# Altium schematic sheet LEAKCAM.SchDoc
size A2; SheetNumber: 1; SheetTotal: 8
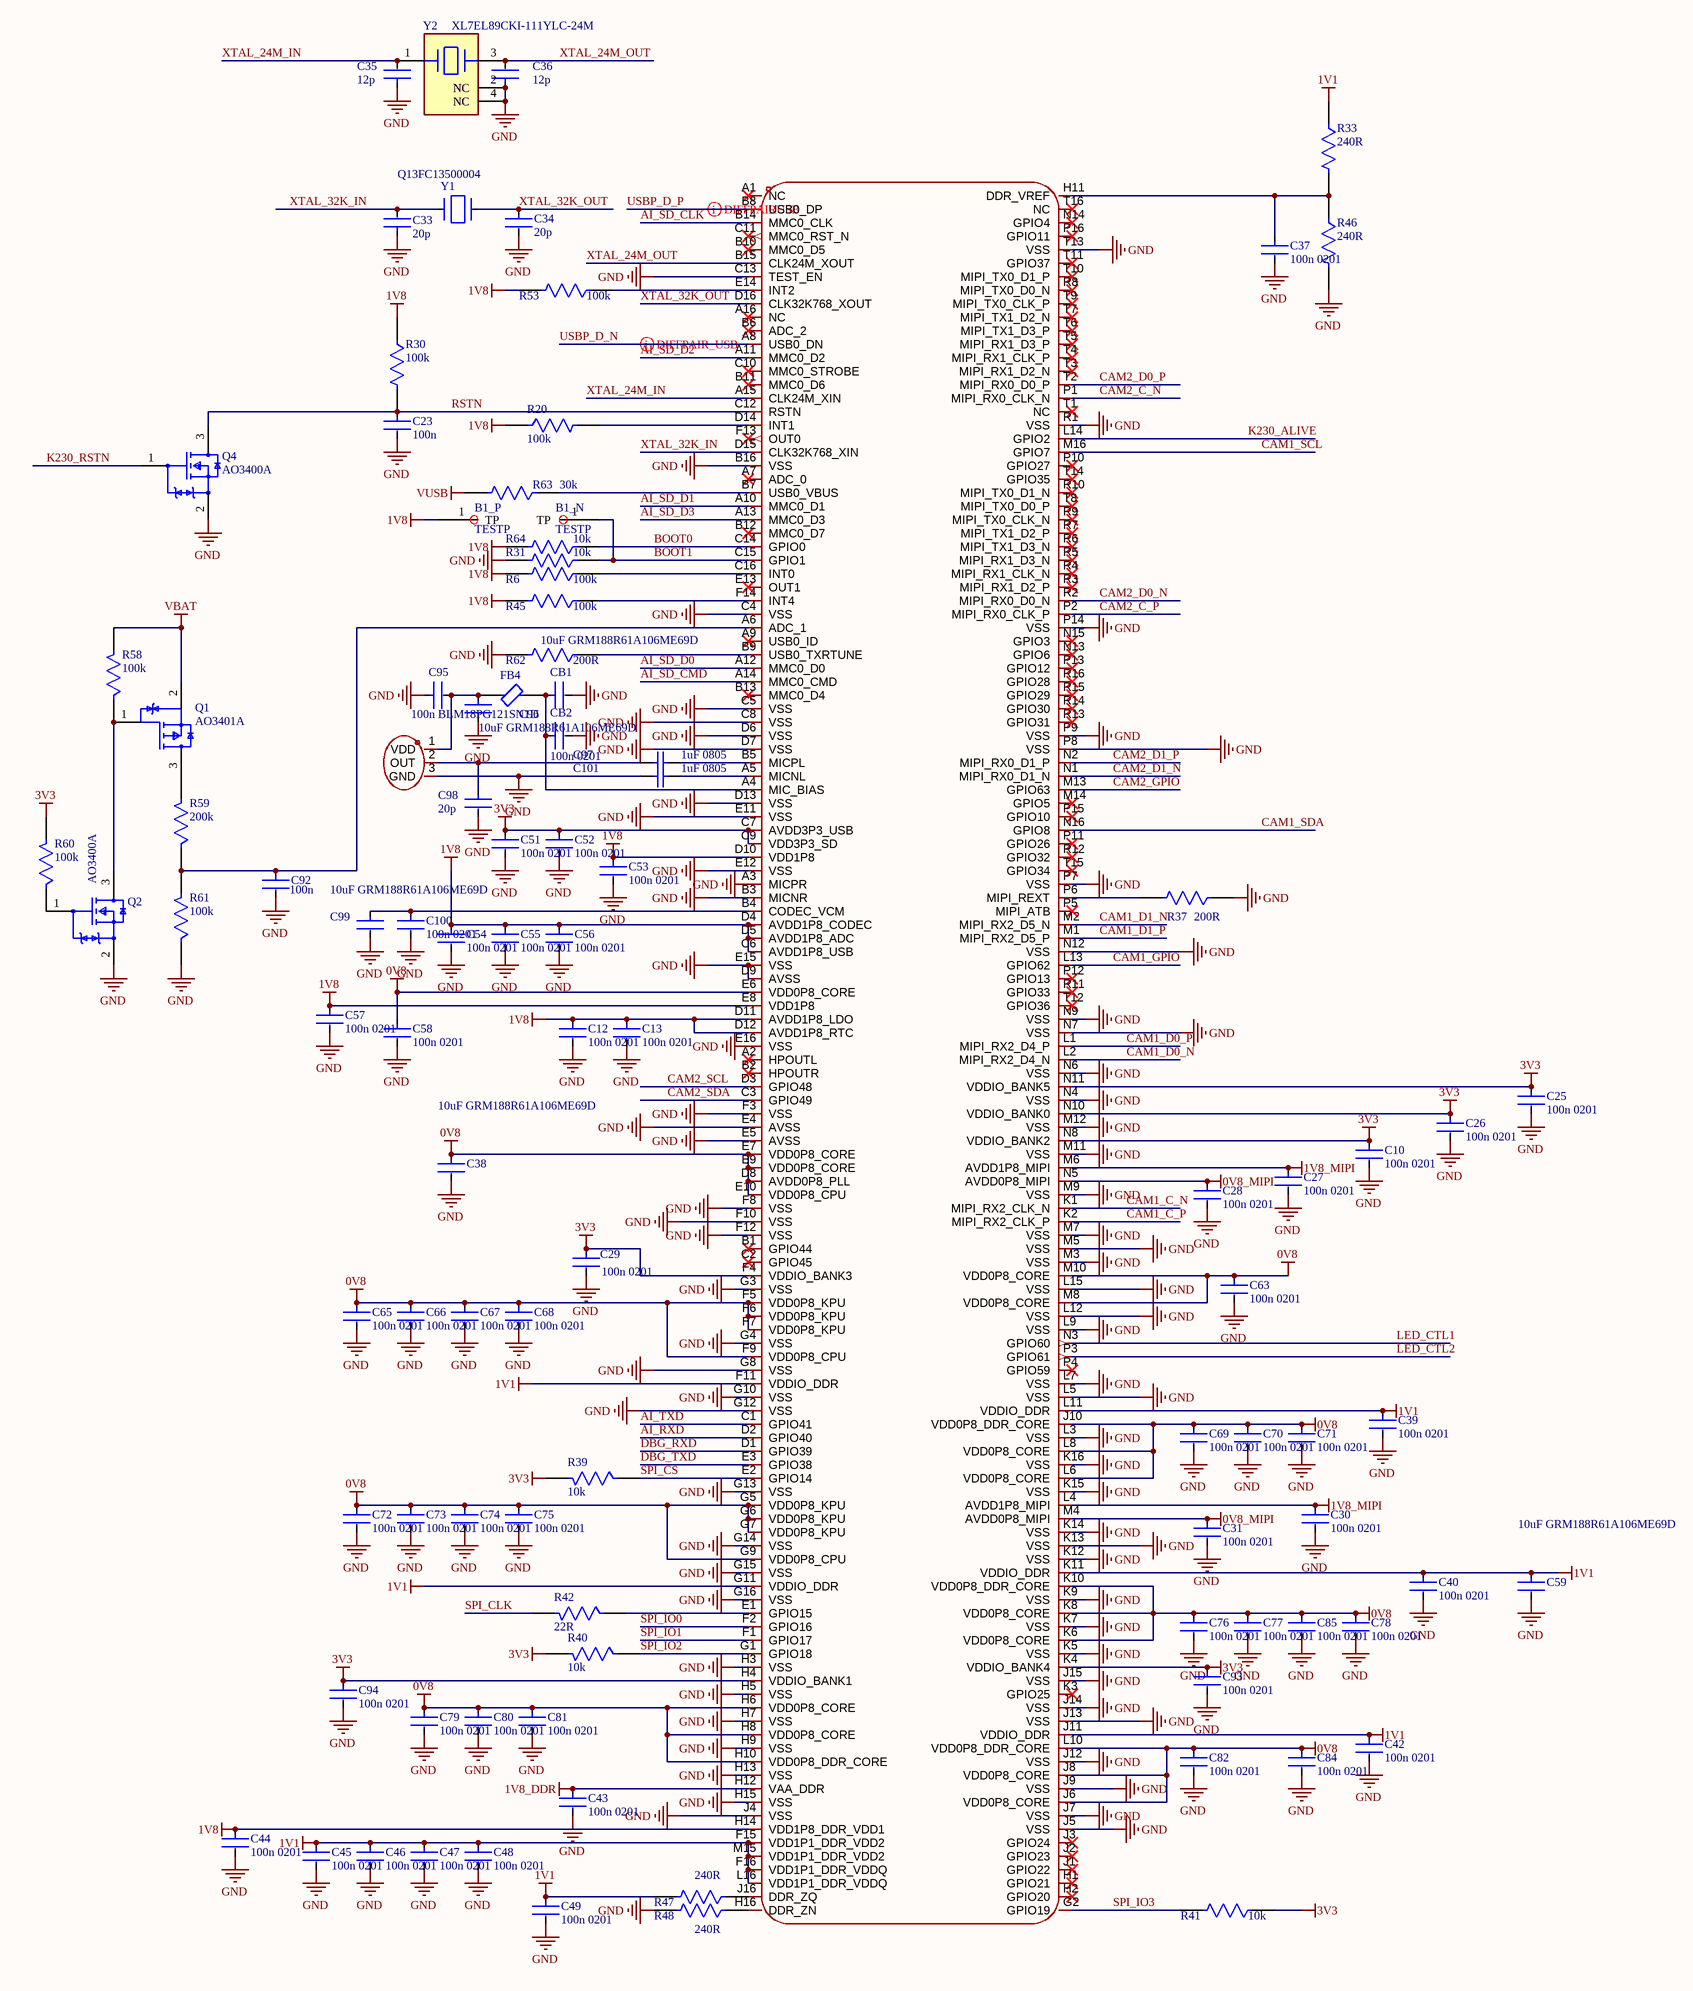
[diagram p0: LEAKCAM.SchDoc]

## Parts
B1_N  TESTP  [TESTP]
B1_P  TESTP  [TESTP]
C10  100n 0201  [CAP_0201]
C12  100n 0201  [CAP_0201]
C13  100n 0201  [CAP_0201]
C23  100n  [CAP_0402]
C25  100n 0201  [CAP_0201]
C26  100n 0201  [CAP_0201]
C27  100n 0201  [CAP_0201]
C28  100n 0201  [CAP_0201]
C29  100n 0201  [CAP_0201]
C30  100n 0201  [CAP_0201]
C31  100n 0201  [CAP_0201]
C33  20p  [CAP_0402]
C34  20p  [CAP_0402]
C35  12p  [CAP_0402]
C36  12p  [CAP_0402]
C37  100n 0201  [CAP_0201]
C38  10uF GRM188R61A106ME69D  [FP-GRM188-0_15-MFG]
C39  100n 0201  [CAP_0201]
C40  100n 0201  [CAP_0201]
C42  100n 0201  [CAP_0201]
C43  100n 0201  [CAP_0201]
C44  100n 0201  [CAP_0201]
C45  100n 0201  [CAP_0201]
C46  100n 0201  [CAP_0201]
C47  100n 0201  [CAP_0201]
C48  100n 0201  [CAP_0201]
C49  100n 0201  [CAP_0201]
C51  100n 0201  [CAP_0201]
C52  100n 0201  [CAP_0201]
C53  100n 0201  [CAP_0201]
C54  100n 0201  [CAP_0201]
C55  100n 0201  [CAP_0201]
C56  100n 0201  [CAP_0201]
C57  100n 0201  [CAP_0201]
C58  100n 0201  [CAP_0201]
C59  10uF GRM188R61A106ME69D  [FP-GRM188-0_15-MFG]
C63  100n 0201  [CAP_0201]
C65  100n 0201  [CAP_0201]
C66  100n 0201  [CAP_0201]
C67  100n 0201  [CAP_0201]
C68  100n 0201  [CAP_0201]
C69  100n 0201  [CAP_0201]
C70  100n 0201  [CAP_0201]
C71  100n 0201  [CAP_0201]
C72  100n 0201  [CAP_0201]
C73  100n 0201  [CAP_0201]
C74  100n 0201  [CAP_0201]
C75  100n 0201  [CAP_0201]
C76  100n 0201  [CAP_0201]
C77  100n 0201  [CAP_0201]
C78  100n 0201  [CAP_0201]
C79  100n 0201  [CAP_0201]
C80  100n 0201  [CAP_0201]
C81  100n 0201  [CAP_0201]
C82  100n 0201  [CAP_0201]
C84  100n 0201  [CAP_0201]
C85  100n 0201  [CAP_0201]
C92  100n  [CAP_0402]
C93  100n 0201  [CAP_0201]
C94  100n 0201  [CAP_0201]
C95  100n  [CAP_0402]
C96  10uF GRM188R61A106ME69D  [FP-GRM188-0_15-MFG]
C97  1uF 0805  [CAPC2013X145X50NL20T20]
C98  20p  [CAP_0402]
C99  10uF GRM188R61A106ME69D  [FP-GRM188-0_15-MFG]
C100  100n 0201  [CAP_0201]
C101  1uF 0805  [CAPC2013X145X50NL20T20]
CB1  10uF GRM188R61A106ME69D  [FP-GRM188-0_15-MFG]
CB2  100n 0201  [CAP_0201]
FB4  BLM18PG121SN1D  [FP-BLM18-0_15-t0_8-IPC_B]
Q1  AO3401A  [FP-SOT23-IPC_B]
Q2  AO3400A  [FP-SOT23-MFG]
Q4  AO3400A  [FP-SOT23-MFG]
R6  100k  [RES_0402]
R20  100k  [RES_0402]
R30  100k  [RES_0402]
R31  10k  [RES_0402]
R33  240R  [RES_0402]
R37  200R  [RES_0402]
R39  10k  [RES_0402]
R40  10k  [RES_0402]
R41  10k  [RES_0402]
R42  22R  [RES_0402]
R45  100k  [RES_0402]
R46  240R  [RES_0402]
R47  240R  [RES_0402]
R48  240R  [RES_0402]
R53  100k  [RES_0402]
R58  100k  [RES_0402]
R59  200k  [RES_0402]
R60  100k  [RES_0402]
R61  100k  [RES_0402]
R62  200R  [RES_0402]
R63  30k  [RES_0402]
R64  10k  [RES_0402]
U3  k230d  [K230D]  (value not drawn)
U13  msm381acb026  [mems]  (value not drawn)
Y1  Q13FC13500004  [FP-ABS07-MFG]
Y2  XL7EL89CKI-111YLC-24M  [FP-XRCGB_F_N-MFG]

## Nets
0V8: C38.1 C58.1 C63.1 C65.1 C66.1 C67.1 C68.1 C69.1 C70.1 C71.1 C72.1 C73.1 C74.1 C75.1 C76.1 C77.1 C78.1 C79.1 C80.1 C81.1 C82.1 C84.1 C85.1 U3.D8(AVDD0P8_PLL) U3.E6(VDD0P8_CORE) U3.E7(VDD0P8_CORE) U3.E9(VDD0P8_CORE) U3.E10(VDD0P8_CPU) U3.F5(VDD0P8_KPU) U3.F6(VDD0P8_KPU) U3.F7(VDD0P8_KPU) U3.F9(VDD0P8_CPU) U3.G5(VDD0P8_KPU) U3.G6(VDD0P8_KPU) U3.G7(VDD0P8_KPU) U3.G9(VDD0P8_CPU) U3.H6(VDD0P8_CORE) U3.H8(VDD0P8_CORE) U3.H10(VDD0P8_DDR_CORE) U3.J6(VDD0P8_CORE) U3.J8(VDD0P8_CORE) U3.J10(VDD0P8_DDR_CORE) U3.K6(VDD0P8_CORE) U3.K8(VDD0P8_CORE) U3.K10(VDD0P8_DDR_CORE) U3.L6(VDD0P8_CORE) U3.L8(VDD0P8_CORE) U3.L10(VDD0P8_DDR_CORE) U3.M8(VDD0P8_CORE) U3.M10(VDD0P8_CORE)
0V8_MIPI: C28.1 C31.1 U3.M4(AVDD0P8_MIPI) U3.N5(AVDD0P8_MIPI)
1V1: C39.1 C40.1 C42.1 C45.1 C46.1 C47.1 C48.1 C49.1 C59.1 R33.1 R47.2 U3.F11(VDDIO_DDR) U3.F15(VDD1P1_DDR_VDD2) U3.F16(VDD1P1_DDR_VDDQ) U3.G11(VDDIO_DDR) U3.J11(VDDIO_DDR) U3.K11(VDDIO_DDR) U3.L11(VDDIO_DDR) U3.L16(VDD1P1_DDR_VDDQ) U3.M15(VDD1P1_DDR_VDD2)
1V8: B1_P.1(TP) C12.1 C13.1 C44.1 C53.1 C54.1 C55.1 C56.1 C57.1 R6.2 R20.1 R30.1 R45.2 R53.2 R64.2 U3.C6(AVDD1P8_USB) U3.D4(AVDD1P8_CODEC) U3.D5(AVDD1P8_ADC) U3.D10(VDD1P8) U3.D11(AVDD1P8_LDO) U3.D12(AVDD1P8_RTC) U3.E8(VDD1P8) U3.H14(VDD1P8_DDR_VDD1)
1V8_DDR: C43.1 U3.H12(VAA_DDR)
1V8_MIPI: C27.1 C30.1 U3.L4(AVDD1P8_MIPI) U3.M6(AVDD1P8_MIPI)
3V3: C10.1 C25.1 C26.1 C29.1 C51.1 C52.1 C93.1 C94.1 R39.2 R40.2 R41.1 R60.2 U3.C7(AVDD3P3_USB) U3.C9(VDD3P3_SD) U3.F4(VDDIO_BANK3) U3.H4(VDDIO_BANK1) U3.K4(VDDIO_BANK4) U3.N8(VDDIO_BANK2) U3.N10(VDDIO_BANK0) U3.N11(VDDIO_BANK5)
GND: C10.2 C12.2 C13.2 C23.2 C25.2 C26.2 C27.2 C28.2 C29.2 C30.2 C31.2 C33.1 C34.2 C35.1 C36.1 C37.2 C38.2 C39.2 C40.2 C42.2 C43.2 C44.2 C45.2 C46.2 C47.2 C48.2 C49.2 C51.2 C52.2 C53.2 C54.2 C55.2 C56.2 C57.2 C58.2 C59.2 C63.2 C65.2 C66.2 C67.2 C68.2 C69.2 C70.2 C71.2 C72.2 C73.2 C74.2 C75.2 C76.2 C77.2 C78.2 C79.2 C80.2 C81.2 C82.2 C84.2 C85.2 C92.2 C93.2 C94.2 C95.1 C96.2 C98.2 C99.2 C100.2 C101.1 CB1.2 CB2.2 Q2.2(S) Q4.2(S) R31.2 R37.1 R46.2 R48.2 R61.1 R62.2 U3.A3(MICPR) U3.B3(MICNR) U3.B16(VSS) U3.C4(VSS) U3.C5(VSS) U3.C8(VSS) U3.C13(TEST_EN) U3.D6(VSS) U3.D7(VSS) U3.D9(AVSS) U3.D13(VSS) U3.E4(AVSS) U3.E5(AVSS) U3.E11(VSS) U3.E12(VSS) U3.E15(VSS) U3.E16(VSS) U3.F3(VSS) U3.F8(VSS) U3.F10(VSS) U3.F12(VSS) U3.G3(VSS) U3.G4(VSS) U3.G8(VSS) U3.G10(VSS) U3.G12(VSS) U3.G13(VSS) U3.G14(VSS) U3.G15(VSS) U3.G16(VSS) U3.H3(VSS) U3.H5(VSS) U3.H7(VSS) U3.H9(VSS) U3.H13(VSS) U3.H15(VSS) U3.J4(VSS) U3.J5(VSS) U3.J7(VSS) U3.J9(VSS) U3.J12(VSS) U3.J13(VSS) U3.J14(VSS) U3.J15(VSS) U3.K5(VSS) U3.K7(VSS) U3.K9(VSS) U3.K12(VSS) U3.K13(VSS) U3.K14(VSS) U3.K15(VSS) U3.K16(VSS) U3.L3(VSS) U3.L5(VSS) U3.L7(VSS) U3.L9(VSS) U3.L12(VSS) U3.L15(VSS) U3.M3(VSS) U3.M5(VSS) U3.M7(VSS) U3.M9(VSS) U3.M11(VSS) U3.M12(VSS) U3.N4(VSS) U3.N6(VSS) U3.N7(VSS) U3.N9(VSS) U3.N12(VSS) U3.P7(VSS) U3.P8(VSS) U3.P9(VSS) U3.P14(VSS) U3.R1(VSS) U3.T13(VSS) U13.3(GND) Y2.2(NC) Y2.4(NC)
VBAT: Q1.2(S) R58.2
VUSB: R63.2
AI_RXD: U3.D2(GPIO40)
AI_SD_CLK: U3.B14(MMC0_CLK)
AI_SD_CMD: U3.A14(MMC0_CMD)
AI_SD_D0: U3.A12(MMC0_D0)
AI_SD_D1: U3.A10(MMC0_D1)
AI_SD_D2: U3.A11(MMC0_D2)
AI_SD_D3: U3.A13(MMC0_D3)
AI_TXD: U3.C1(GPIO41)
BOOT0: R64.1 U3.C14(GPIO0)
BOOT1: B1_N.1(TP) R31.1 U3.C15(GPIO1)
CAM1_C_N: U3.K1(MIPI_RX2_CLK_N)
CAM1_C_P: U3.K2(MIPI_RX2_CLK_P)
CAM1_D0_N: U3.L2(MIPI_RX2_D4_N)
CAM1_D0_P: U3.L1(MIPI_RX2_D4_P)
CAM1_D1_N: U3.M2(MIPI_RX2_D5_N)
CAM1_D1_P: U3.M1(MIPI_RX2_D5_P)
CAM1_GPIO: U3.L13(GPIO62)
CAM1_SCL: U3.M16(GPIO7)
CAM1_SDA: U3.N16(GPIO8)
CAM2_C_N: U3.P1(MIPI_RX0_CLK_N)
CAM2_C_P: U3.P2(MIPI_RX0_CLK_P)
CAM2_D0_N: U3.R2(MIPI_RX0_D0_N)
CAM2_D0_P: U3.T2(MIPI_RX0_D0_P)
CAM2_D1_N: U3.N1(MIPI_RX0_D1_N)
CAM2_D1_P: U3.N2(MIPI_RX0_D1_P)
CAM2_GPIO: U3.M13(GPIO63)
CAM2_SCL: U3.D3(GPIO48)
CAM2_SDA: U3.C3(GPIO49)
DBG_RXD: U3.D1(GPIO39)
DBG_TXD: U3.E3(GPIO38)
K230_ALIVE: U3.L14(GPIO2)
K230_RSTN: Q4.1(G)
LED_CTL1: U3.N3(GPIO60)
LED_CTL2: U3.P3(GPIO61)
RSTN: C23.1 Q4.3(D) R30.2 U3.C12(RSTN)
SPI_CLK: R42.2
SPI_CS: R39.1 U3.E2(GPIO14)
SPI_IO0: U3.F2(GPIO16)
SPI_IO1: U3.F1(GPIO17)
SPI_IO2: R40.1 U3.G1(GPIO18)
SPI_IO3: R41.2 U3.G2(GPIO19)
USBP_D_N: U3.A8(USB0_DN)
USBP_D_P: U3.B8(USB0_DP)
XTAL_24M_IN: C35.2 U3.A15(CLK24M_XIN) Y2.1(1_Input/Output)
XTAL_24M_OUT: C36.2 U3.B15(CLK24M_XOUT) Y2.3(2_Input/Output)
XTAL_32K_IN: C33.2 U3.D15(CLK32K768_XIN) Y1.1
XTAL_32K_OUT: C34.1 U3.D16(CLK32K768_XOUT) Y1.2
NetC37_1: C37.1 R33.2 R46.1 U3.H11(DDR_VREF)
NetC92_1: C92.1 R59.1 R61.2 U3.A6(ADC_1)
NetC95_2: C95.2 C96.1 FB4.1 U13.1(VDD)
NetC97_1: C97.1 C98.1 U13.2(OUT)
NetC97_2: C97.2 U3.B5(MICPL)
NetC99_1: C99.1 C100.1 U3.B4(CODEC_VCM)
NetC101_2: C101.2 U3.A5(MICNL)
NetCB1_1: CB1.1 CB2.1 FB4.2 U3.A4(MIC_BIAS)
NetQ1_1: Q1.1(G) Q2.3(D) R58.1
NetQ1_3: Q1.3(D) R59.2
NetQ2_1: Q2.1(G) R60.1
NetR6_1: R6.1 U3.C16(INT0)
NetR20_2: R20.2 U3.D14(INT1)
NetR37_2: R37.2 U3.P6(MIPI_REXT)
NetR42_1: R42.1 U3.E1(GPIO15)
NetR45_1: R45.1 U3.F14(INT4)
NetR47_1: R47.1 U3.J16(DDR_ZQ)
NetR48_1: R48.1 U3.H16(DDR_ZN)
NetR53_1: R53.1 U3.E14(INT2)
NetR62_1: R62.1 U3.B9(USB0_TXRTUNE)
NetR63_1: R63.1 U3.B7(USB0_VBUS)

Not connected (* = marked no-connect by the designer): U3 A1(NC)* A2(HPOUTL)* A7(ADC_0)* A9(USB0_ID)* A16(NC)* B1(GPIO44)* B2(HPOUTR)* B6(ADC_2)* B10(MMC0_D5)* B11(MMC0_D6)* B12(MMC0_D7)* B13(MMC0_D4)* C2(GPIO45)* C10(MMC0_STROBE)* C11(MMC0_RST_N)* E13(OUT1)* F13(OUT0)* H1(GPIO21)* H2(GPIO20)* J1(GPIO22)* J2(GPIO23)* J3(GPIO24)* K3(GPIO25)* M14(GPIO5)* N13(GPIO6)* N14(GPIO4)* N15(GPIO3)* P4(GPIO59)* P5(MIPI_ATB)* P10(GPIO27)* P11(GPIO26)* P12(GPIO13)* P13(GPIO12)* P15(GPIO10)* P16(GPIO11)* R3(MIPI_RX1_D2_P)* R4(MIPI_RX1_CLK_N)* R5(MIPI_RX1_D3_N)* R6(MIPI_TX1_D3_N)* R7(MIPI_TX1_D2_P)* R8(MIPI_TX0_D0_N)* R9(MIPI_TX0_CLK_N)* R10(MIPI_TX0_D1_N)* R11(GPIO33)* R12(GPIO32)* R13(GPIO31)* R14(GPIO30)* R15(GPIO29)* R16(GPIO28)* T1(NC)* T3(MIPI_RX1_D2_N)* T4(MIPI_RX1_CLK_P)* T5(MIPI_RX1_D3_P)* T6(MIPI_TX1_D3_P)* T7(MIPI_TX1_D2_N)* T8(MIPI_TX0_D0_P)* T9(MIPI_TX0_CLK_P)* T10(MIPI_TX0_D1_P)* T11(GPIO37)* T12(GPIO36)* T14(GPIO35)* T15(GPIO34)* T16(NC)*

## Layout directives
differential pair; differential pair class USB: USBP_D_N, USBP_D_P

## Library data of the parts
C10 C12 C13 C25-C31 C37 C39 C40 C42-C49 C51-C58 C63 C65-C82 C84 C85 C93 C94 C100 = CMP-03422-001116-1: C2903663; Manufacturer: Yageo; Manufacturer Part Number: CC0201KRX5R7BB223; Material: Ceramic; Tolerance: 0.1; Temperature Coefficient: 15%; Temperature Characteristic: X5R; Value: 100nF; Voltage Rating: 16 V; Automotive: No; Device Class L1: Passive Components; Lead Free: Yes; ComponentLink2URL: http://www.yageo.com/documents/recent/UPY-GPHC_X5R_4V-to-50V_25.pdf; RoHS: TRUE; Height: 0.33mm; Capacitance: 100nF; Package: CC0201-BA; Temperature Range Low: -55°C; Footprint Url: http://www.yageo.com/exep/pages/download/literatures/UPY-C_GEN_24.pdf; Temperature Range High: +85°C; ComponentLink2Description: Datasheet; Device Class L3: Ceramic Capacitors; Ipc Land Pattern Name: CAPC6030X30; Temperature: -55°C to +85°C; Category: Cap; Device Class L2: Capacitors; Octopart: https://octopart.com/cc0201krx5r7bb223-yageo-90326712
C23 C92 C95 = CMP-03422-001116-1: C307331; Tolerance: 10%; Voltage Rating: 50V; Capacitance: 100nF; Value: 100nF; Max Operating Temperature: 125°C; Case Code (Metric): 1005; RoHS Compliant: Yes; Series: -; Case Code (Imperial): 0402; Min Operating Temperature: -55°C; Mount: Surface Mount; Case/Package: 0402; Packaging: Cut Tape
C33 C34 C98 = CMP-03422-001116-1: C1554; Tolerance: 10%; Voltage Rating: 50V; Capacitance: 20pF; Value: 20pF; Max Operating Temperature: 125°C; Case Code (Metric): 1005; RoHS Compliant: Yes; Series: -; Case Code (Imperial): 0402; Min Operating Temperature: -55°C; Mount: Surface Mount; Case/Package: 0402; Packaging: Cut Tape
C35 C36 = CMP-03422-001116-1: C1547; Tolerance: 10%; Voltage Rating: 50V; Capacitance: 12pF; Value: 12pF; Max Operating Temperature: 125°C; Case Code (Metric): 1005; RoHS Compliant: Yes; Series: -; Case Code (Imperial): 0402; Min Operating Temperature: -55°C; Mount: Surface Mount; Case/Package: 0402; Packaging: Cut Tape
C38 C59 C96 C99 = CMP-06035-003612-1: C19702; Tolerance: 20%; Dielectric: X5R; Voltage Rating: 10V; Material: Ceramic; Package Quantity: 4000; Width: 0.8mm; Case/Package: 0603; Thickness: 0.035inch; Capacitance: 10uF; Voltage Rating (DC): 10V; Termination: SMD/SMT; Length: 1.6mm; Lead Free: Lead Free; Mount: Surface Mount; Height: 0.8mm; Depth: 0.8mm; Packaging: Tape and Reel; Weight: 0.000222oz; Min Operating Temperature: -55°C; Case Code (Metric): 1608; Max Operating Temperature: 85°C; Case Code (Imperial): 0603; Value: 10uF
C97 C101 = CMP-2007-01676-1: C28323; Part Number: VJ0805Y105KXQRW1BC; Manufacturer: Vitramon; Value: 1uF; Capacitance: 1uF
CB1 = CMP-06035-003612-1: C19702; Tolerance: 20%; Dielectric: X5R; Voltage Rating: 10V; Package Quantity: 4000; Width: 0.8mm; Case/Package: 0603; Thickness: 0.035inch; Capacitance: 10uF; Voltage Rating (DC): 10V; Termination: SMD/SMT; Length: 1.6mm; Lead Free: Lead Free; Mount: Surface Mount; Height: 0.8mm; Depth: 0.8mm; Packaging: Tape and Reel; Weight: 0.000222oz; Min Operating Temperature: -55°C; Case Code (Metric): 1608; Max Operating Temperature: 85°C; Case Code (Imperial): 0603; Material: Ceramic; Value: 10uF
CB2 = CMP-03422-001116-1: C2903663; Manufacturer: Yageo; Manufacturer Part Number: CC0201KRX5R7BB223; Tolerance: 0.1; Temperature Coefficient: 15%; Temperature Characteristic: X5R; Value: 100nF; Voltage Rating: 16 V; Material: Ceramic; Automotive: No; Device Class L1: Passive Components; Lead Free: Yes; ComponentLink2URL: http://www.yageo.com/documents/recent/UPY-GPHC_X5R_4V-to-50V_25.pdf; RoHS: TRUE; Height: 0.33mm; Capacitance: 100nF; Package: CC0201-BA; Temperature Range Low: -55°C; Footprint Url: http://www.yageo.com/exep/pages/download/literatures/UPY-C_GEN_24.pdf; Temperature Range High: +85°C; ComponentLink2Description: Datasheet; Device Class L3: Ceramic Capacitors; Ipc Land Pattern Name: CAPC6030X30; Temperature: -55°C to +85°C; Category: Cap; Device Class L2: Capacitors; Octopart: https://octopart.com/cc0201krx5r7bb223-yageo-90326712
FB4 = CMP-0686-00439-3: C14709; DC Resistance (DCR): 180mR; Number of Lines: 1; Current Rating: 500mA; Material: Steel; Core Material: Ferrite; Impedance: 120R; Tolerance: 25%; Test Frequency: 100MHz; Shielding: Unshielded; Case/Package: 0603; Max Operating Temperature: 125°C; Min Operating Temperature: -55°C; Series: BLM18A; Case Code (Metric): 1608; DC Resistance-Max: 180mR; Package Quantity: 1; Radiation Hardening: No; Length: 1.6mm; Lead Free: Lead Free; Max DC Current: 500mA; Termination: SMD/SMT; Number of Pins: 2; Military Standard: Not; REACH SVHC: No SVHC; Number of Circuits: 1; Max Current Rating: 500mA; Depth: 0.8mm; Frequency: 100MHz; Width: 0.8mm; Case Code (Imperial): 0603; DC Current: 500mA; Height: 0.8mm; RoHS Compliant: Yes; Packaging: Tape and Reel
Q1 = CMP-12801-000081-1: C15127; Continuous Drain Current (ID): 2.4A; Rds On Max: 160mR; Input Capacitance: 156pF; Drain to Source Voltage (Vdss): 20V; Max Power Dissipation: 840mW; Max Operating Temperature: 150°C; Packaging: Tape and Reel; Case/Package: TO-236-3; Min Operating Temperature: -55°C; Mount: Surface Mount
Q2 Q4 = CMP-12801-000001-1: C20917; Manufacturer Part Number: DMG2302UK-7; Manufacturer: Diodes Inc.; Reverse Recovery Time: 5.3ns; Gate Charge At Vgs: 2.8nC @ 10V; Drain To Source Voltage: 20V; Turn On Delay Time: 0.6ns; Pulse Drain Current: 12A; Max Forward Diode Voltage: 1.2V; Reverse Recovery Charge: 0.5nC; Automotive Grade: Grade 0; Threshold Vgs Min: 0.3V; Number Of N Channels: 1; Standoff Height: 0.013mm; Typ Forward Diode Voltage: 0.7V; Continuous Drain Current: 2.8A; Drain To Source Resistance: 61mΩ; Rthja Max: 192°C/W; Max Junction Temp: +150°C; Input Capacitace At Vds: 130pF @ 10V; Threshold Vgs Max: 1V; Turn Off Delay Time: 4.2ns; Depletion Mode: False; Gate To Source Voltage: 12V; Power Dissipation: 0.66W; Device Class L1: Discrete Semiconductors; Footprint Url: https://www.diodes.com/assets/Package-Files/SOT23.pdf; Lead Free: Yes; Temperature Range High: +150°C; Category: Trans; Digikey Description: MOSFET N-CH 20V 2.8A SOT23; RoHS: TRUE; Device Class L2: Transistors; Height: 1.1mm; Automotive: Yes; Package: SOT23; Drain To Source Breakdown Voltage: 20V; ComponentLink2Description: Datasheet; Device Class L3: MOSFETs; Octopart: https://octopart.com/dmg2302uk-7-diodes+inc.-73850182; Temperature Range Low: -55°C; Temperature: -55°C to +150°C; Number Of Channels: 1; ComponentLink2URL: https://www.diodes.com/assets/Datasheets/DMG2302UK.pdf
R6 R20 R30 R45 R53 R58 R60 R61 = CMP-03412-016018-1: C25741; Tolerance: 1%; Temperature Coefficient: 100ppm/°C; Resistance: 100kOhm; Max Power Dissipation: 63mW; Value: 100kOhm; Ratings: AEC-Q200; Resistor Type: Thick Film; Number of Terminations: 2; RoHS Compliant: Yes; Min Operating Temperature: -55°C; Case/Package: 0402; Series: AC; Length: 0.039inch; Width: 0.02inch; Features: Moisture Resistant; Height: 0.015inch; Packaging: Tape and Reel; Max Operating Temperature: 155°C
R31 R39-R41 R64 = CMP-03412-016018-1: C25744; Tolerance: 1%; Temperature Coefficient: 100ppm/°C; Resistance: 10kOhm; Max Power Dissipation: 63mW; Value: 10kOhm; Ratings: AEC-Q200; Resistor Type: Thick Film; Number of Terminations: 2; RoHS Compliant: Yes; Min Operating Temperature: -55°C; Case/Package: 0402; Series: AC; Length: 0.039inch; Width: 0.02inch; Features: Moisture Resistant; Height: 0.015inch; Packaging: Tape and Reel; Max Operating Temperature: 155°C
R33 R46-R48 = CMP-03412-016018-1: C324768; Tolerance: 1%; Temperature Coefficient: 100ppm/°C; Resistance: 240Ohm; Max Power Dissipation: 63mW; Value: 240Ohm; Ratings: AEC-Q200; Resistor Type: Thick Film; Number of Terminations: 2; RoHS Compliant: Yes; Min Operating Temperature: -55°C; Case/Package: 0402; Series: AC; Length: 0.039inch; Width: 0.02inch; Features: Moisture Resistant; Height: 0.015inch; Packaging: Tape and Reel; Max Operating Temperature: 155°C
R37 R62 = CMP-03412-016018-1: C25087; Tolerance: 1%; Temperature Coefficient: 100ppm/°C; Resistance: 200Ohm; Max Power Dissipation: 63mW; Value: 200Ohm; Ratings: AEC-Q200; Resistor Type: Thick Film; Number of Terminations: 2; RoHS Compliant: Yes; Min Operating Temperature: -55°C; Case/Package: 0402; Series: AC; Length: 0.039inch; Width: 0.02inch; Features: Moisture Resistant; Height: 0.015inch; Packaging: Tape and Reel; Max Operating Temperature: 155°C
R42 = CMP-03412-016018-1: C25092; Tolerance: 1%; Temperature Coefficient: 100ppm/°C; Resistance: 22Ohm; Max Power Dissipation: 63mW; Value: 22Ohm; Ratings: AEC-Q200; Resistor Type: Thick Film; Number of Terminations: 2; RoHS Compliant: Yes; Min Operating Temperature: -55°C; Case/Package: 0402; Series: AC; Length: 0.039inch; Width: 0.02inch; Features: Moisture Resistant; Height: 0.015inch; Packaging: Tape and Reel; Max Operating Temperature: 155°C
R59 = CMP-03412-016018-1: C25764; Tolerance: 1%; Temperature Coefficient: 100ppm/°C; Resistance: 200kOhm; Max Power Dissipation: 63mW; Value: 200kOhm; Ratings: AEC-Q200; Resistor Type: Thick Film; Number of Terminations: 2; RoHS Compliant: Yes; Min Operating Temperature: -55°C; Case/Package: 0402; Series: AC; Length: 0.039inch; Width: 0.02inch; Features: Moisture Resistant; Height: 0.015inch; Packaging: Tape and Reel; Max Operating Temperature: 155°C
R63 = CMP-03412-016018-1: C49653548; Tolerance: 1%; Temperature Coefficient: 100ppm/°C; Resistance: 30kOhm; Max Power Dissipation: 63mW; Value: 30kOhm; Ratings: AEC-Q200; Resistor Type: Thick Film; Number of Terminations: 2; RoHS Compliant: Yes; Min Operating Temperature: -55°C; Case/Package: 0402; Series: AC; Length: 0.039inch; Width: 0.02inch; Features: Moisture Resistant; Height: 0.015inch; Packaging: Tape and Reel; Max Operating Temperature: 155°C
U3 = k230d: C42414902; Manufacturer: Canaan(嘉楠); AddInBom: yes; ModelId: 5e2811f3a7254058be5ff42f0a018083; ModelName: BGA-256_L11.0-W11.0-P0.65-BL; ModelTransform: 433.07,433.07,0,90,0,0,0,0,0; Symbol: K230D; LCSC Part Name: K230平台及其特性; SupplierPart: C42414902; ManufacturerPart: K230D; Supplier Footprint: BGA-256; JLCPCB Part Class: Extended Part; Datasheet: https://item.szlcsc.com/datasheet/K230D/44408979.html; Supplier: LCSC; ConvertToPcb: yes; FootprintName: BGA-256_L11.0-W11.0-P0.65-BL; Features: Calendar function；Power-on reset (POR)；True random number generator (TRNG)；Watchdog reset；Built-in general-purpose timer；Hardware CRC；Software reset
U13 = msm381acb026: C51928208; Manufacturer: MEMS(敏芯微); AddInBom: yes; Direction: Omnidirectional; Voltage - Supply: 3.6V; Current Consumption: 175uA; S/N Ratio: 64dB; Sensitivity: -38dB; Impedance: 170Ω; Output Type: Analog output; Symbol: MSM381ACB026; LCSC Part Name: 3.6V -38dB; SupplierPart: C51928208; ManufacturerPart: MSM381ACB026; Supplier Footprint: LGA-3(1.9x2.8); JLCPCB Part Class: Extended Part; Datasheet: https://item.szlcsc.com/datasheet/MSM381ACB026/54640763.html; Supplier: LCSC; ConvertToPcb: yes; FootprintName: MIC-SMD_L2.8-W1.9_MSM381ACB026; Length: 2.75mm; Width: 1.85mm; Height: 0.9mm; Features: Omnidirectional pickup
Y1 = CMP-0447-00001-4: C32346; Frequency: 32.768kHz; ESR (Equivalent Series Resistance): 70kR; Frequency Tolerance: 20ppm; Load Capacitance: 12.5pF; Operating Frequency: 32.768 kHz; Radiation Hardening: No; Length: 3.2mm; Max Operating Temperature: 85°C; Number of Pins: 2; Series: ABS07; Min Operating Temperature: -40°C; Packaging: Tape and Reel; Height: 0.9mm; Width: 1.5mm; Depth: 1.5mm; RoHS Compliant: Yes; Tolerance: 20ppm; Termination: SMD/SMT; Lead Free: Lead Free; Series Resistance: 70kR; REACH SVHC: No SVHC; Case/Package: CSMD; Package Quantity: 3000
Y2 = CMP-06054-000017-1: C2965580; ESR (Equivalent Series Resistance): 150R; Operating Frequency: 24 MHz; Tolerance: 30ppm; Frequency: 24MHz; Load Capacitance: 6pF; Frequency Stability: 40ppm; Length: 2mm; Height: 0.028inch; Lead Free: Lead Free; Min Operating Temperature: -30°C; REACH SVHC: No SVHC; RoHS Compliant: Yes; Series Resistance: 150R; Mount: Surface Mount; Packaging: Tape and Reel; Termination: SMD/SMT; Case/Package: SMD/SMT; Max Operating Temperature: 85°C; Width: 1.6mm; Number of Pins: 4; Package Quantity: 1; Depth: 1.6mm; Frequency Tolerance: 30ppm; Series: XRCGB